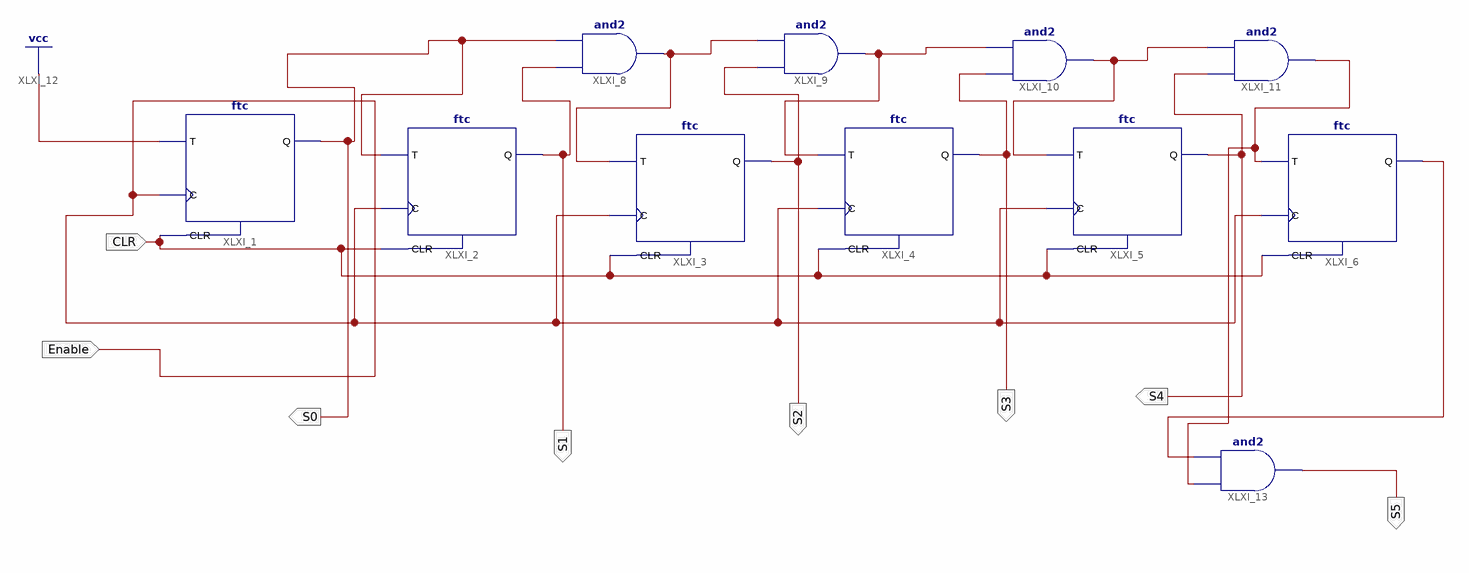
[diagram p0: schematic sheet 1]
// Xilinx ISE schematic contador.sch (spartan3e) as structural Verilog: 11 symbols, 8 ports
module contador (
  input  CLR,
  input  Enable,
  output S0,
  output S1,
  output S2,
  output S3,
  output S4,
  output S5
);

  wire XLXN_31, XLXN_33, XLXN_35, XLXN_44, XLXN_45;

  ftc XLXI_1 (.C(Enable), .CLR(CLR), .T(1'b1), .Q(S0));
  ftc XLXI_2 (.C(Enable), .CLR(CLR), .T(S0), .Q(S1));
  ftc XLXI_3 (.C(Enable), .CLR(CLR), .T(XLXN_31), .Q(S2));
  ftc XLXI_4 (.C(Enable), .CLR(CLR), .T(XLXN_33), .Q(S3));
  ftc XLXI_5 (.C(Enable), .CLR(CLR), .T(XLXN_35), .Q(S4));
  ftc XLXI_6 (.C(Enable), .CLR(CLR), .T(XLXN_45), .Q(XLXN_44));
  and XLXI_8 (XLXN_31, S1, S0);
  and XLXI_9 (XLXN_33, S2, XLXN_31);
  and XLXI_10 (XLXN_35, S3, XLXN_33);
  and XLXI_11 (XLXN_45, S4, XLXN_35);
  and XLXI_13 (S5, XLXN_45, XLXN_44);
endmodule
